# EasyEDA Pro project ROM外接板.eprj, schematic Schematic1
Board Name: Board1; Create Date: 2024-08-28; Page Name: P1; Project Name: ROM外接板; Schematic Name: Schematic1; Update Date: 2024-09-22; Company: 嘉立创EDA; Drawed: wiselook; Page Size: A4; Version: V1.0
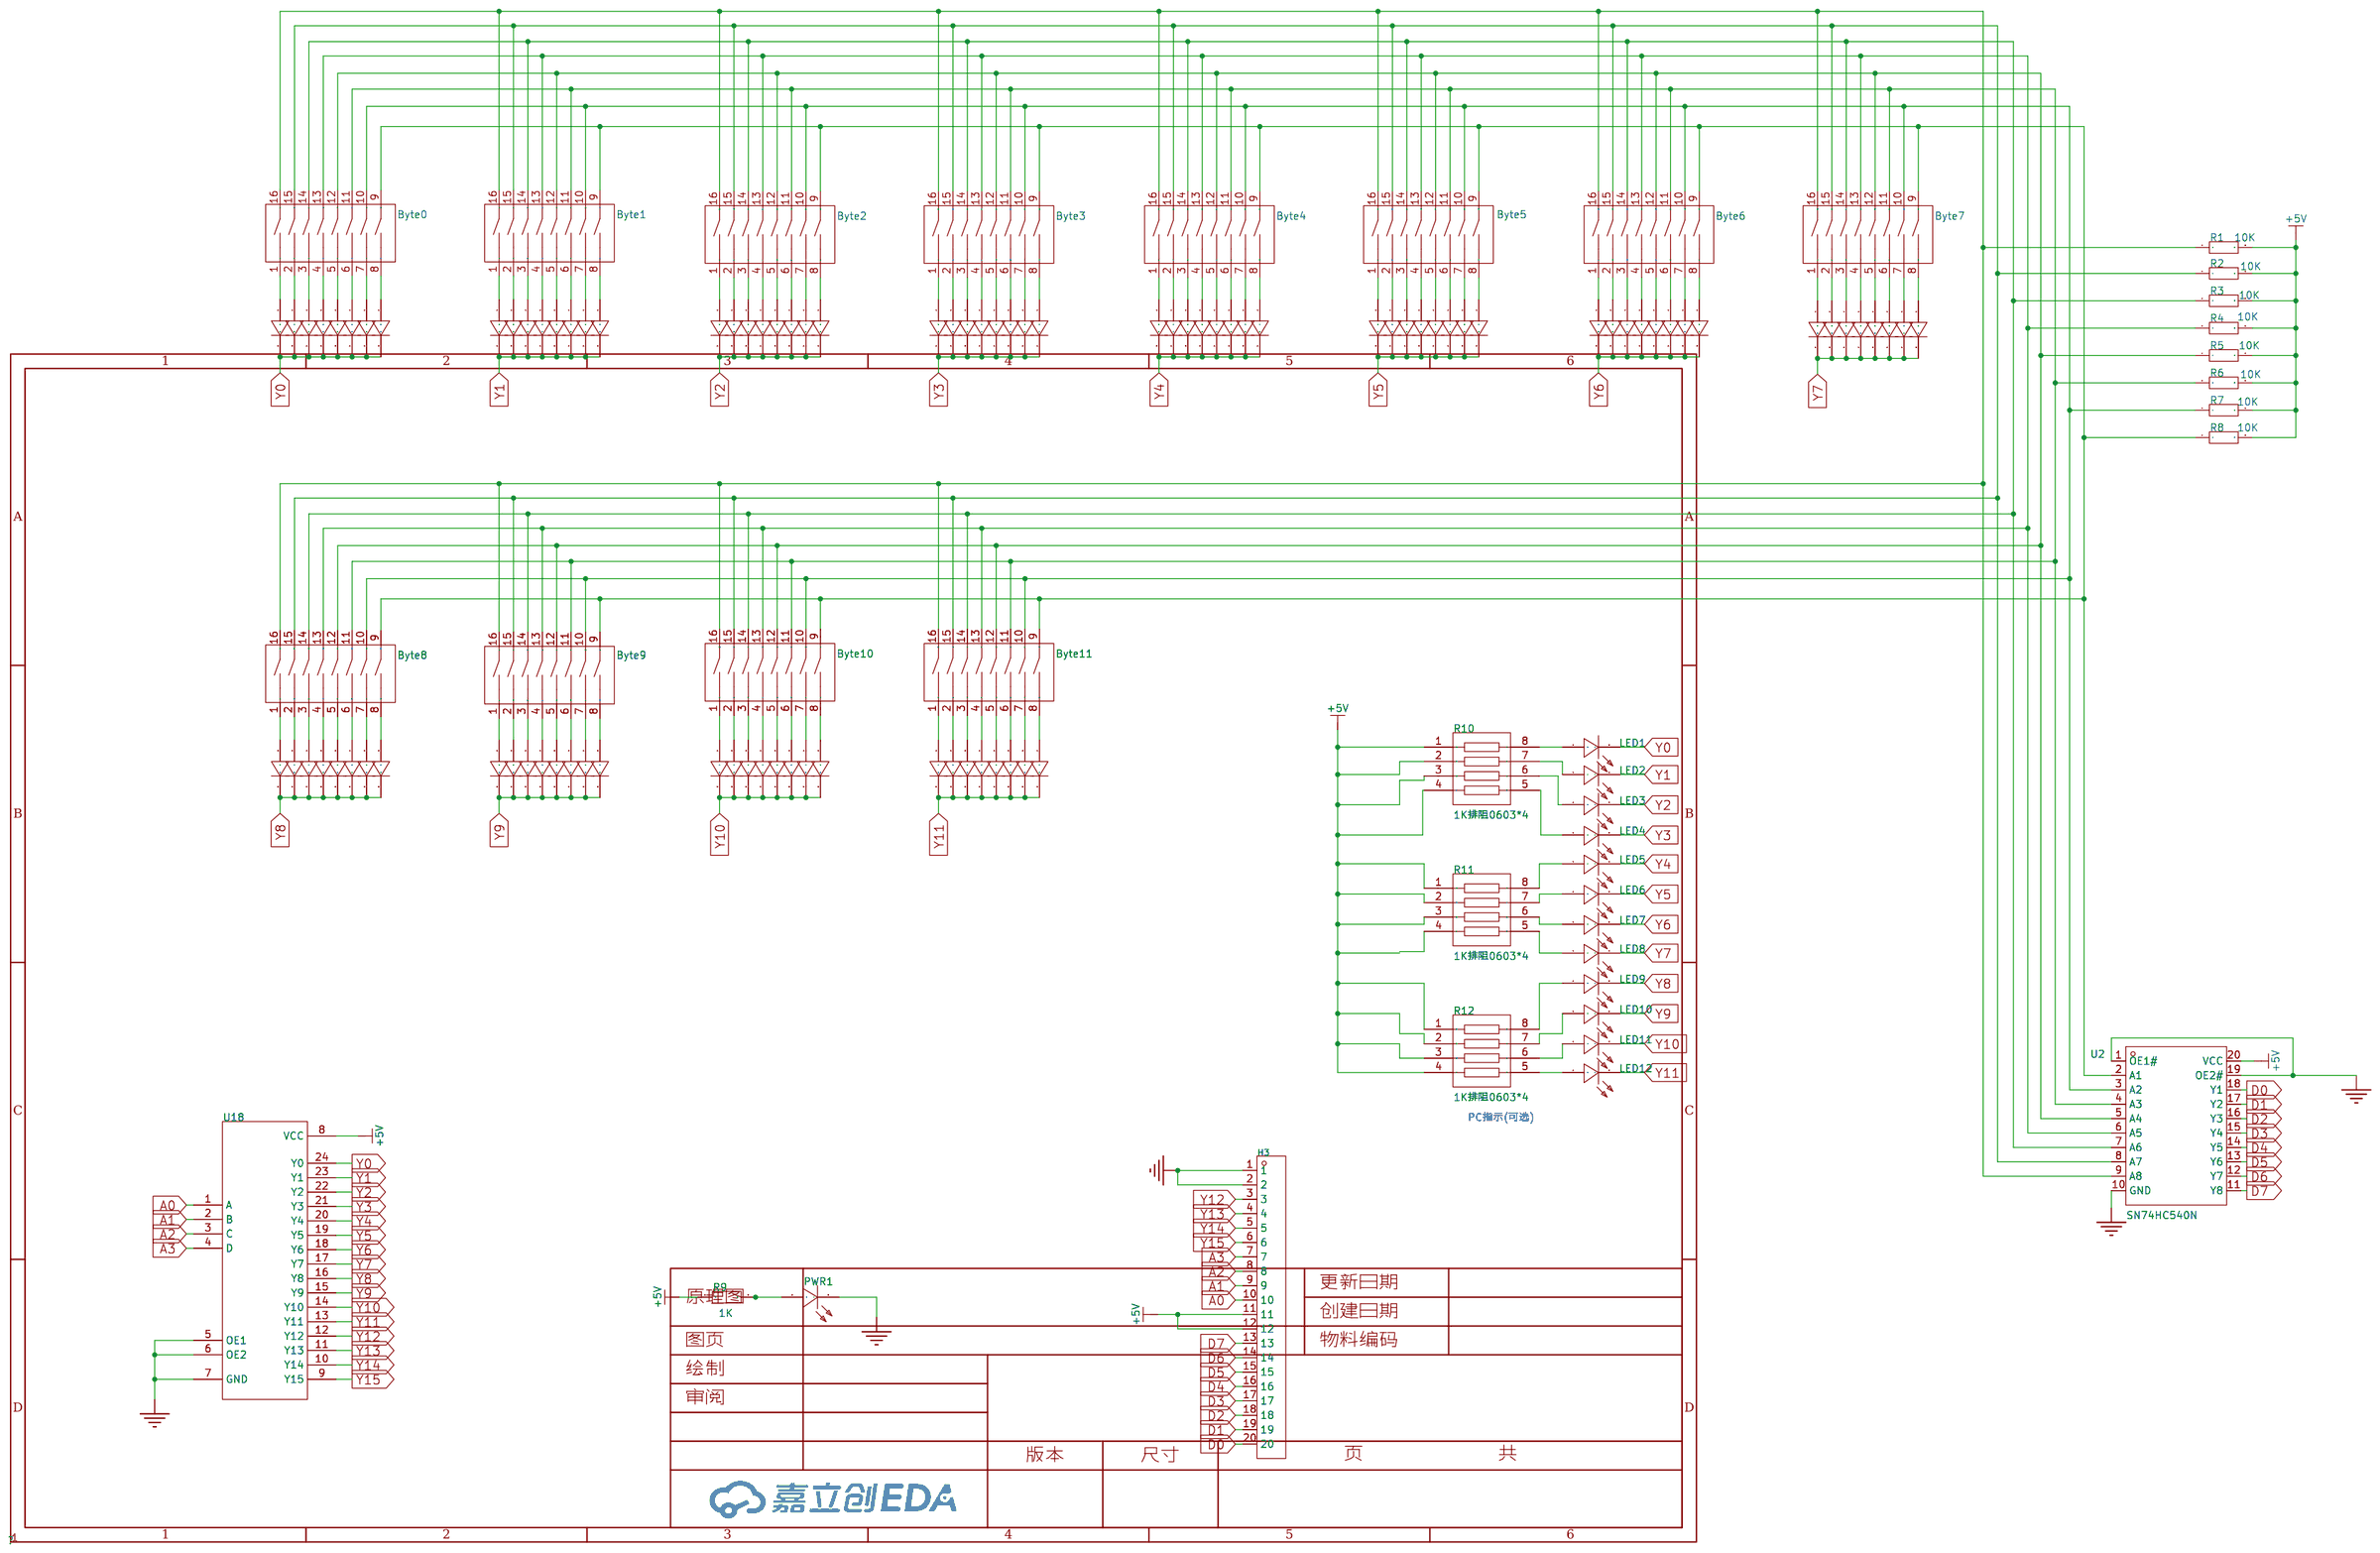
[diagram p0: schematic sheet]

## Parts
Byte0  2.54插件8位拨码开关  [SW-TH_16P-L21.9-W9.9-P2.54-LS7.8]
Byte1  2.54插件8位拨码开关  [SW-TH_16P-L21.9-W9.9-P2.54-LS7.8]
Byte2  2.54插件8位拨码开关  [SW-TH_16P-L21.9-W9.9-P2.54-LS7.8]
Byte3  2.54插件8位拨码开关  [SW-TH_16P-L21.9-W9.9-P2.54-LS7.8]
Byte4  2.54插件8位拨码开关  [SW-TH_16P-L21.9-W9.9-P2.54-LS7.8]
Byte5  2.54插件8位拨码开关  [SW-TH_16P-L21.9-W9.9-P2.54-LS7.8]
Byte6  2.54插件8位拨码开关  [SW-TH_16P-L21.9-W9.9-P2.54-LS7.8]
Byte7  2.54插件8位拨码开关  [SW-TH_16P-L21.9-W9.9-P2.54-LS7.8]
Byte8  2.54插件8位拨码开关  [SW-TH_16P-L21.9-W9.9-P2.54-LS7.8]
Byte9  2.54插件8位拨码开关  [SW-TH_16P-L21.9-W9.9-P2.54-LS7.8]
Byte10  2.54插件8位拨码开关  [SW-TH_16P-L21.9-W9.9-P2.54-LS7.8]
Byte11  2.54插件8位拨码开关  [SW-TH_16P-L21.9-W9.9-P2.54-LS7.8]
D1  1N4148  [DO-35_BD2.0-L4.0-P8.00-D0.5-FD]
D2  1N4148  [DO-35_BD2.0-L4.0-P8.00-D0.5-FD]
D3  1N4148  [DO-35_BD2.0-L4.0-P8.00-D0.5-FD]
D4  1N4148  [DO-35_BD2.0-L4.0-P8.00-D0.5-FD]
D5  1N4148  [DO-35_BD2.0-L4.0-P8.00-D0.5-FD]
D6  1N4148  [DO-35_BD2.0-L4.0-P8.00-D0.5-FD]
D7  1N4148  [DO-35_BD2.0-L4.0-P8.00-D0.5-FD]
D8  1N4148  [DO-35_BD2.0-L4.0-P8.00-D0.5-FD]
D9  1N4148  [DO-35_BD2.0-L4.0-P8.00-D0.5-FD]
D10  1N4148  [DO-35_BD2.0-L4.0-P8.00-D0.5-FD]
D11  1N4148  [DO-35_BD2.0-L4.0-P8.00-D0.5-FD]
D12  1N4148  [DO-35_BD2.0-L4.0-P8.00-D0.5-FD]
D13  1N4148  [DO-35_BD2.0-L4.0-P8.00-D0.5-FD]
D14  1N4148  [DO-35_BD2.0-L4.0-P8.00-D0.5-FD]
D15  1N4148  [DO-35_BD2.0-L4.0-P8.00-D0.5-FD]
D16  1N4148  [DO-35_BD2.0-L4.0-P8.00-D0.5-FD]
D17  1N4148  [DO-35_BD2.0-L4.0-P8.00-D0.5-FD]
D18  1N4148  [DO-35_BD2.0-L4.0-P8.00-D0.5-FD]
D19  1N4148  [DO-35_BD2.0-L4.0-P8.00-D0.5-FD]
D20  1N4148  [DO-35_BD2.0-L4.0-P8.00-D0.5-FD]
D21  1N4148  [DO-35_BD2.0-L4.0-P8.00-D0.5-FD]
D22  1N4148  [DO-35_BD2.0-L4.0-P8.00-D0.5-FD]
D23  1N4148  [DO-35_BD2.0-L4.0-P8.00-D0.5-FD]
D24  1N4148  [DO-35_BD2.0-L4.0-P8.00-D0.5-FD]
D25  1N4148  [DO-35_BD2.0-L4.0-P8.00-D0.5-FD]
D26  1N4148  [DO-35_BD2.0-L4.0-P8.00-D0.5-FD]
D27  1N4148  [DO-35_BD2.0-L4.0-P8.00-D0.5-FD]
D28  1N4148  [DO-35_BD2.0-L4.0-P8.00-D0.5-FD]
D29  1N4148  [DO-35_BD2.0-L4.0-P8.00-D0.5-FD]
D30  1N4148  [DO-35_BD2.0-L4.0-P8.00-D0.5-FD]
D31  1N4148  [DO-35_BD2.0-L4.0-P8.00-D0.5-FD]
D32  1N4148  [DO-35_BD2.0-L4.0-P8.00-D0.5-FD]
D65  1N4148  [DO-35_BD2.0-L4.0-P8.00-D0.5-FD]
D66  1N4148  [DO-35_BD2.0-L4.0-P8.00-D0.5-FD]
D67  1N4148  [DO-35_BD2.0-L4.0-P8.00-D0.5-FD]
D68  1N4148  [DO-35_BD2.0-L4.0-P8.00-D0.5-FD]
D69  1N4148  [DO-35_BD2.0-L4.0-P8.00-D0.5-FD]
D70  1N4148  [DO-35_BD2.0-L4.0-P8.00-D0.5-FD]
D71  1N4148  [DO-35_BD2.0-L4.0-P8.00-D0.5-FD]
D72  1N4148  [DO-35_BD2.0-L4.0-P8.00-D0.5-FD]
D73  1N4148  [DO-35_BD2.0-L4.0-P8.00-D0.5-FD]
D74  1N4148  [DO-35_BD2.0-L4.0-P8.00-D0.5-FD]
D75  1N4148  [DO-35_BD2.0-L4.0-P8.00-D0.5-FD]
D76  1N4148  [DO-35_BD2.0-L4.0-P8.00-D0.5-FD]
D77  1N4148  [DO-35_BD2.0-L4.0-P8.00-D0.5-FD]
D78  1N4148  [DO-35_BD2.0-L4.0-P8.00-D0.5-FD]
D79  1N4148  [DO-35_BD2.0-L4.0-P8.00-D0.5-FD]
D80  1N4148  [DO-35_BD2.0-L4.0-P8.00-D0.5-FD]
D81  1N4148  [DO-35_BD2.0-L4.0-P8.00-D0.5-FD]
D82  1N4148  [DO-35_BD2.0-L4.0-P8.00-D0.5-FD]
D83  1N4148  [DO-35_BD2.0-L4.0-P8.00-D0.5-FD]
D84  1N4148  [DO-35_BD2.0-L4.0-P8.00-D0.5-FD]
D85  1N4148  [DO-35_BD2.0-L4.0-P8.00-D0.5-FD]
D86  1N4148  [DO-35_BD2.0-L4.0-P8.00-D0.5-FD]
D87  1N4148  [DO-35_BD2.0-L4.0-P8.00-D0.5-FD]
D88  1N4148  [DO-35_BD2.0-L4.0-P8.00-D0.5-FD]
D89  1N4148  [DO-35_BD2.0-L4.0-P8.00-D0.5-FD]
D90  1N4148  [DO-35_BD2.0-L4.0-P8.00-D0.5-FD]
D91  1N4148  [DO-35_BD2.0-L4.0-P8.00-D0.5-FD]
D92  1N4148  [DO-35_BD2.0-L4.0-P8.00-D0.5-FD]
D93  1N4148  [DO-35_BD2.0-L4.0-P8.00-D0.5-FD]
D94  1N4148  [DO-35_BD2.0-L4.0-P8.00-D0.5-FD]
D95  1N4148  [DO-35_BD2.0-L4.0-P8.00-D0.5-FD]
D96  1N4148  [DO-35_BD2.0-L4.0-P8.00-D0.5-FD]
D97  1N4148  [DO-35_BD2.0-L4.0-P8.00-D0.5-FD]
D98  1N4148  [DO-35_BD2.0-L4.0-P8.00-D0.5-FD]
D99  1N4148  [DO-35_BD2.0-L4.0-P8.00-D0.5-FD]
D100  1N4148  [DO-35_BD2.0-L4.0-P8.00-D0.5-FD]
D101  1N4148  [DO-35_BD2.0-L4.0-P8.00-D0.5-FD]
D102  1N4148  [DO-35_BD2.0-L4.0-P8.00-D0.5-FD]
D103  1N4148  [DO-35_BD2.0-L4.0-P8.00-D0.5-FD]
D104  1N4148  [DO-35_BD2.0-L4.0-P8.00-D0.5-FD]
D105  1N4148  [DO-35_BD2.0-L4.0-P8.00-D0.5-FD]
D106  1N4148  [DO-35_BD2.0-L4.0-P8.00-D0.5-FD]
D107  1N4148  [DO-35_BD2.0-L4.0-P8.00-D0.5-FD]
D108  1N4148  [DO-35_BD2.0-L4.0-P8.00-D0.5-FD]
D109  1N4148  [DO-35_BD2.0-L4.0-P8.00-D0.5-FD]
D110  1N4148  [DO-35_BD2.0-L4.0-P8.00-D0.5-FD]
D111  1N4148  [DO-35_BD2.0-L4.0-P8.00-D0.5-FD]
D112  1N4148  [DO-35_BD2.0-L4.0-P8.00-D0.5-FD]
D113  1N4148  [DO-35_BD2.0-L4.0-P8.00-D0.5-FD]
D114  1N4148  [DO-35_BD2.0-L4.0-P8.00-D0.5-FD]
D115  1N4148  [DO-35_BD2.0-L4.0-P8.00-D0.5-FD]
D116  1N4148  [DO-35_BD2.0-L4.0-P8.00-D0.5-FD]
D117  1N4148  [DO-35_BD2.0-L4.0-P8.00-D0.5-FD]
D118  1N4148  [DO-35_BD2.0-L4.0-P8.00-D0.5-FD]
D119  1N4148  [DO-35_BD2.0-L4.0-P8.00-D0.5-FD]
D120  1N4148  [DO-35_BD2.0-L4.0-P8.00-D0.5-FD]
D121  1N4148  [DO-35_BD2.0-L4.0-P8.00-D0.5-FD]
D122  1N4148  [DO-35_BD2.0-L4.0-P8.00-D0.5-FD]
D123  1N4148  [DO-35_BD2.0-L4.0-P8.00-D0.5-FD]
D124  1N4148  [DO-35_BD2.0-L4.0-P8.00-D0.5-FD]
D125  1N4148  [DO-35_BD2.0-L4.0-P8.00-D0.5-FD]
D126  1N4148  [DO-35_BD2.0-L4.0-P8.00-D0.5-FD]
D127  1N4148  [DO-35_BD2.0-L4.0-P8.00-D0.5-FD]
D128  1N4148  [DO-35_BD2.0-L4.0-P8.00-D0.5-FD]
H3  KH-A2541WR-20P  [HDR-TH_20P-P2.54-H-M-W10.5]
LED1  KT-0805Y  [LED0805-R-RD]
LED2  KT-0805Y  [LED0805-R-RD]
LED3  KT-0805Y  [LED0805-R-RD]
LED4  KT-0805Y  [LED0805-R-RD]
LED5  KT-0805Y  [LED0805-R-RD]
LED6  KT-0805Y  [LED0805-R-RD]
LED7  KT-0805Y  [LED0805-R-RD]
LED8  KT-0805Y  [LED0805-R-RD]
LED9  KT-0805Y  [LED0805-R-RD]
LED10  KT-0805Y  [LED0805-R-RD]
LED11  KT-0805Y  [LED0805-R-RD]
LED12  KT-0805Y  [LED0805-R-RD]
PWR1  KT-0805Y  [LED0805-R-RD]
R1  10K  [R_AXIAL-0.4]
R2  10K  [R_AXIAL-0.4]
R3  10K  [R_AXIAL-0.4]
R4  10K  [R_AXIAL-0.4]
R5  10K  [R_AXIAL-0.4]
R6  10K  [R_AXIAL-0.4]
R7  10K  [R_AXIAL-0.4]
R8  10K  [R_AXIAL-0.4]
R9  1K  [R0805]
R10  1K排阻0603*4  [RES-ARRAY-SMD_0603-8P-L3.2-W1.6-TL]
R11  1K排阻0603*4  [RES-ARRAY-SMD_0603-8P-L3.2-W1.6-TL]
R12  1K排阻0603*4  [RES-ARRAY-SMD_0603-8P-L3.2-W1.6-TL]
U2  SN74HC540N  [DIP-20_L25.4-W10.2-P2.54-LS10.2-BL_SOCKET]
U18  -  [DIP-24_L30.5-W10.2-P2.54-LS7.6-BL_IC-24P]

## Library data of the parts
Byte0-Byte11 = 2.54插件8位拨码开关: Supplier Part: C9900005795; Supplier Footprint: 插件; JLCPCB Part Class: 扩展库; Supplier: LCSC
D1-D32 D65-D128 = 1N4148_C258182: LCSC Part Name: 电压:100V 电流:200mA; Supplier Part: C258182; Manufacturer: onsemi(安森美); Supplier Footprint: DO-35; Datasheet: https://atta.szlcsc.com/upload/public/pdf/source/20180829/C258182_3EE2D0AB6109C1B72B054FC50B8BC8AD.pdf; Supplier: LCSC; Forward Voltage (Vf@If): 1V@10mA; Reverse Voltage (Vr): 100V; Average Rectified Current (Io): 200mA; Reverse Leakage Current: 5uA@75V; Reverse Recovery Time (trr): 4ns; Operating Temperature: -55℃~+175℃@(Tj)
H3 = KH-A2541WR-20P: LCSC Part Name: 间距:2.54mm 1x20P 弯插 方针; Supplier Part: C2833328; Manufacturer: kinghelm(金航标); Supplier Footprint: 弯插,P=2.54mm; JLCPCB Part Class: 扩展库; Datasheet: https://atta.szlcsc.com/upload/public/pdf/source/20210520/C2833328_938AAB0962E6BD852BF1FEB1DD56FE90.pdf; Supplier: LCSC; Pin Structure: 1x20P; Pitch: 2.54mm; Circluar Pins/Square Pins: 方针; Mounting Type: 弯插; Number of Rows: 单排; Number of Pins: 20P; Current Rating (Max): 3A; Voltage Rating (Max): 250V; Length of Mating Pin: 6mm; Insulation Height: 2.54mm; Operating Temperature Range: -40℃~+105℃; Color: 黑色
LED1-LED12 PWR1 = KT-0805Y: LCSC Part Name: 0805 黄灯 高亮; Supplier Part: C2296; Manufacturer: KENTO; Supplier Footprint: 0805; JLCPCB Part Class: 基础库; Datasheet: https://atta.szlcsc.com/upload/public/pdf/source/20160421/1461205044170.pdf; Supplier: LCSC; Emitted Color: 黄色
R1-R9 = Res_0805: Supplier Footprint: 0805
R10-R12 = 91K排阻0603*4: Supplier Part: C9900007684; Supplier Footprint: 0603*4; JLCPCB Part Class: Extended Part; Supplier: LCSC
U2 = SN74HC540N: Supplier Part: C1548133; Manufacturer: TI(德州仪器); Supplier Footprint: PDIP-20; Datasheet: https://www.ti.com/cn/lit/gpn/sn74hc540; Supplier: LCSC; output type: 三态; Supply Voltage: 2V~6V; Number of Elements: 1; Number of Bits per Element: 8; Sink Current: 7.8mA; Source Current: 7.8mA; Logic Family: 74HC; Operating Temperature: -40℃~+85℃
U18 = SN74HC154NT: 4-16译码器

## Nets
+5V: H3.11 H3.12 R1.2 R2.2 R3.2 R4.2 R5.2 R6.2 R7.2 R8.2 R9.1 R10.1 R10.2 R10.3 R10.4 R11.1 R11.2 R11.3 R12.1 R12.2 R12.3 R12.4 U2.20(VCC) U18.8(VCC)
GND: H3.1 H3.2 PWR1.2(-) U2.1(OE1#) U2.10(GND) U2.19(OE2#) U18.5(OE1) U18.6(OE2) U18.7(GND)
A0: H3.10 U18.1(A)
A1: H3.9 U18.2(B)
A2: H3.8 U18.3(C)
A3: H3.7 U18.4(D)
D0: H3.20 U2.18(Y1)
D1: H3.19 U2.17(Y2)
D2: H3.18 U2.16(Y3)
D3: H3.17 U2.15(Y4)
D4: H3.16 U2.14(Y5)
D5: H3.15 U2.13(Y6)
D6: H3.14 U2.12(Y7)
D7: H3.13 U2.11(Y8)
Y0: D65.2(K) D66.2(K) D67.2(K) D68.2(K) D69.2(K) D70.2(K) D71.2(K) D72.2(K) LED1.2(-) U18.24(Y0)
Y1: D73.2(K) D74.2(K) D75.2(K) D76.2(K) D77.2(K) D78.2(K) D79.2(K) D80.2(K) LED2.2(-) U18.23(Y1)
Y2: D81.2(K) D82.2(K) D83.2(K) D84.2(K) D85.2(K) D86.2(K) D87.2(K) D88.2(K) LED3.2(-) U18.22(Y2)
Y3: D89.2(K) D90.2(K) D91.2(K) D92.2(K) D93.2(K) D94.2(K) D95.2(K) D96.2(K) LED4.2(-) U18.21(Y3)
Y4: D97.2(K) D98.2(K) D99.2(K) D100.2(K) D101.2(K) D102.2(K) D103.2(K) D104.2(K) LED5.2(-) U18.20(Y4)
Y5: D105.2(K) D106.2(K) D107.2(K) D108.2(K) D109.2(K) D110.2(K) D111.2(K) D112.2(K) LED6.2(-) U18.19(Y5)
Y6: D113.2(K) D114.2(K) D115.2(K) D116.2(K) D117.2(K) D118.2(K) D119.2(K) D120.2(K) LED7.2(-) U18.18(Y6)
Y7: D121.2(K) D122.2(K) D123.2(K) D124.2(K) D125.2(K) D126.2(K) D127.2(K) D128.2(K) LED8.2(-) U18.17(Y7)
Y8: D1.2(K) D2.2(K) D3.2(K) D4.2(K) D5.2(K) D6.2(K) D7.2(K) D8.2(K) LED9.2(-) U18.16(Y8)
Y9: D9.2(K) D10.2(K) D11.2(K) D12.2(K) D13.2(K) D14.2(K) D15.2(K) D16.2(K) LED10.2(-) U18.15(Y9)
Y10: D17.2(K) D18.2(K) D19.2(K) D20.2(K) D21.2(K) D22.2(K) D23.2(K) D24.2(K) LED11.2(-) U18.14(Y10)
Y11: D25.2(K) D26.2(K) D27.2(K) D28.2(K) D29.2(K) D30.2(K) D31.2(K) D32.2(K) LED12.2(-) U18.13(Y11)
Y12: H3.3 U18.12(Y12)
Y13: H3.4 U18.11(Y13)
Y14: H3.5 U18.10(Y14)
Y15: H3.6 U18.9(Y15)
$1N2008: Byte0.9 Byte1.9 Byte2.9 Byte3.9 Byte4.9 Byte5.9 Byte6.9 Byte7.9 Byte8.9 Byte9.9 Byte10.9 Byte11.9 R8.1 U2.2(A1)
$1N2018: Byte0.10 Byte1.10 Byte2.10 Byte3.10 Byte4.10 Byte5.10 Byte6.10 Byte7.10 Byte8.10 Byte9.10 Byte10.10 Byte11.10 R7.1 U2.3(A2)
$1N2040: Byte0.11 Byte1.11 Byte2.11 Byte3.11 Byte4.11 Byte5.11 Byte6.11 Byte7.11 Byte8.11 Byte9.11 Byte10.11 Byte11.11 R6.1 U2.4(A3)
$1N2047: Byte0.12 Byte1.12 Byte2.12 Byte3.12 Byte4.12 Byte5.12 Byte6.12 Byte7.12 Byte8.12 Byte9.12 Byte10.12 Byte11.12 R5.1 U2.5(A4)
$1N2054: Byte0.13 Byte1.13 Byte2.13 Byte3.13 Byte4.13 Byte5.13 Byte6.13 Byte7.13 Byte8.13 Byte9.13 Byte10.13 Byte11.13 R4.1 U2.6(A5)
$1N2067: Byte0.14 Byte1.14 Byte2.14 Byte3.14 Byte4.14 Byte5.14 Byte6.14 Byte7.14 Byte8.14 Byte9.14 Byte10.14 Byte11.14 R3.1 U2.7(A6)
$1N2076: Byte0.15 Byte1.15 Byte2.15 Byte3.15 Byte4.15 Byte5.15 Byte6.15 Byte7.15 Byte8.15 Byte9.15 Byte10.15 Byte11.15 R2.1 U2.8(A7)
$1N2088: Byte0.16 Byte1.16 Byte2.16 Byte3.16 Byte4.16 Byte5.16 Byte6.16 Byte7.16 Byte8.16 Byte9.16 Byte10.16 Byte11.16 R1.1 U2.9(A8)
$1N6851: Byte8.1 D1.1(A)
$1N6855: Byte8.2 D2.1(A)
$1N6860: Byte8.3 D3.1(A)
$1N6865: Byte8.4 D4.1(A)
$1N6870: Byte8.5 D5.1(A)
$1N6875: Byte8.6 D6.1(A)
$1N6883: Byte8.7 D7.1(A)
$1N6888: Byte8.8 D8.1(A)
$1N6957: Byte9.8 D16.1(A)
$1N6961: Byte9.7 D15.1(A)
$1N6966: Byte9.6 D14.1(A)
$1N6971: Byte9.5 D13.1(A)
$1N6976: Byte9.4 D12.1(A)
$1N6981: Byte9.3 D11.1(A)
$1N6986: Byte9.2 D10.1(A)
$1N6991: Byte9.1 D9.1(A)
$1N6994: Byte10.8 D24.1(A)
$1N6996: Byte10.7 D23.1(A)
$1N6998: Byte10.6 D22.1(A)
$1N7000: Byte10.5 D21.1(A)
$1N7002: Byte10.4 D20.1(A)
$1N7004: Byte10.3 D19.1(A)
$1N7006: Byte10.2 D18.1(A)
$1N7008: Byte10.1 D17.1(A)
$1N7010: Byte11.8 D32.1(A)
$1N7012: Byte11.7 D31.1(A)
$1N7014: Byte11.6 D30.1(A)
$1N7016: Byte11.5 D29.1(A)
$1N7018: Byte11.4 D28.1(A)
$1N7020: Byte11.3 D27.1(A)
$1N7022: Byte11.2 D26.1(A)
$1N7024: Byte11.1 D25.1(A)
$1N9458: Byte7.2 D122.1(A)
$1N9460: Byte7.3 D123.1(A)
$1N9462: Byte7.4 D124.1(A)
$1N9464: Byte7.5 D125.1(A)
$1N9466: Byte7.6 D126.1(A)
$1N9468: Byte7.1 D121.1(A)
$1N9470: Byte7.8 D128.1(A)
$1N9472: Byte7.7 D127.1(A)
$1N9474: Byte6.3 D115.1(A)
$1N9476: Byte6.2 D114.1(A)
$1N9478: Byte6.8 D120.1(A)
$1N9480: Byte6.7 D119.1(A)
$1N9482: Byte6.6 D118.1(A)
$1N9484: Byte6.5 D117.1(A)
$1N9486: Byte6.4 D116.1(A)
$1N9488: Byte6.1 D113.1(A)
$1N9490: Byte5.6 D110.1(A)
$1N9492: Byte5.5 D109.1(A)
$1N9494: Byte5.4 D108.1(A)
$1N9496: Byte5.8 D112.1(A)
$1N9498: Byte5.7 D111.1(A)
$1N9500: Byte5.3 D107.1(A)
$1N9502: Byte5.2 D106.1(A)
$1N9504: Byte5.1 D105.1(A)
$1N9506: Byte4.2 D98.1(A)
$1N9508: Byte4.3 D99.1(A)
$1N9510: Byte4.6 D102.1(A)
$1N9512: Byte4.8 D104.1(A)
$1N9514: Byte4.7 D103.1(A)
$1N9516: Byte4.4 D100.1(A)
$1N9518: Byte4.5 D101.1(A)
$1N9520: Byte4.1 D97.1(A)
$1N9528: Byte3.5 D93.1(A)
$1N9530: Byte3.4 D92.1(A)
$1N9532: Byte3.3 D91.1(A)
$1N9534: Byte3.2 D90.1(A)
$1N9536: Byte3.1 D89.1(A)
$1N9538: Byte2.8 D88.1(A)
$1N9542: Byte2.6 D86.1(A)
$1N9544: Byte2.5 D85.1(A)
$1N9546: Byte2.4 D84.1(A)
$1N9548: Byte2.3 D83.1(A)
$1N9554: Byte1.7 D79.1(A)
$1N9556: Byte1.8 D80.1(A)
$1N9558: Byte1.6 D78.1(A)
$1N9560: Byte1.5 D77.1(A)
$1N9562: Byte1.4 D76.1(A)
$1N9564: Byte1.3 D75.1(A)
$1N9566: Byte1.1 D73.1(A)
$1N9568: Byte1.2 D74.1(A)
$1N9570: Byte0.7 D71.1(A)
$1N9572: Byte0.8 D72.1(A)
$1N9574: Byte0.5 D69.1(A)
$1N9576: Byte0.6 D70.1(A)
$1N9578: Byte0.4 D68.1(A)
$1N9580: Byte0.2 D66.1(A)
$1N9582: Byte0.3 D67.1(A)
$1N9584: Byte0.1 D65.1(A)
$1N9668: Byte2.2 D82.1(A)
$1N9672: Byte2.1 D81.1(A)
$1N9677: Byte2.7 D87.1(A)
$1N9761: Byte3.6 D94.1(A)
$1N9765: Byte3.7 D95.1(A)
$1N9770: Byte3.8 D96.1(A)
Net-(LED1-1): LED1.1(+) R10.8
Net-(LED2-1): LED2.1(+) R10.7
Net-(LED3-1): LED3.1(+) R10.6
Net-(LED4-1): LED4.1(+) R10.5
Net-(LED5-1): LED5.1(+) R11.8
Net-(LED6-1): LED6.1(+) R11.7
Net-(LED7-1): LED7.1(+) R11.6
Net-(LED8-1): LED8.1(+) R11.5
Net-(LED9-1): LED9.1(+) R12.8
Net-(LED10-1): LED10.1(+) R12.7
Net-(LED11-1): LED11.1(+) R12.6
Net-(LED12-1): LED12.1(+) R12.5
Net-(PWR1-1): PWR1.1(+) R9.2

Not connected (* = marked no-connect by the designer): R11 4

## Notes on the sheet
- PC指示(可选)
